# Altium schematic sheet Schematic_radio1.SchDoc
size A1
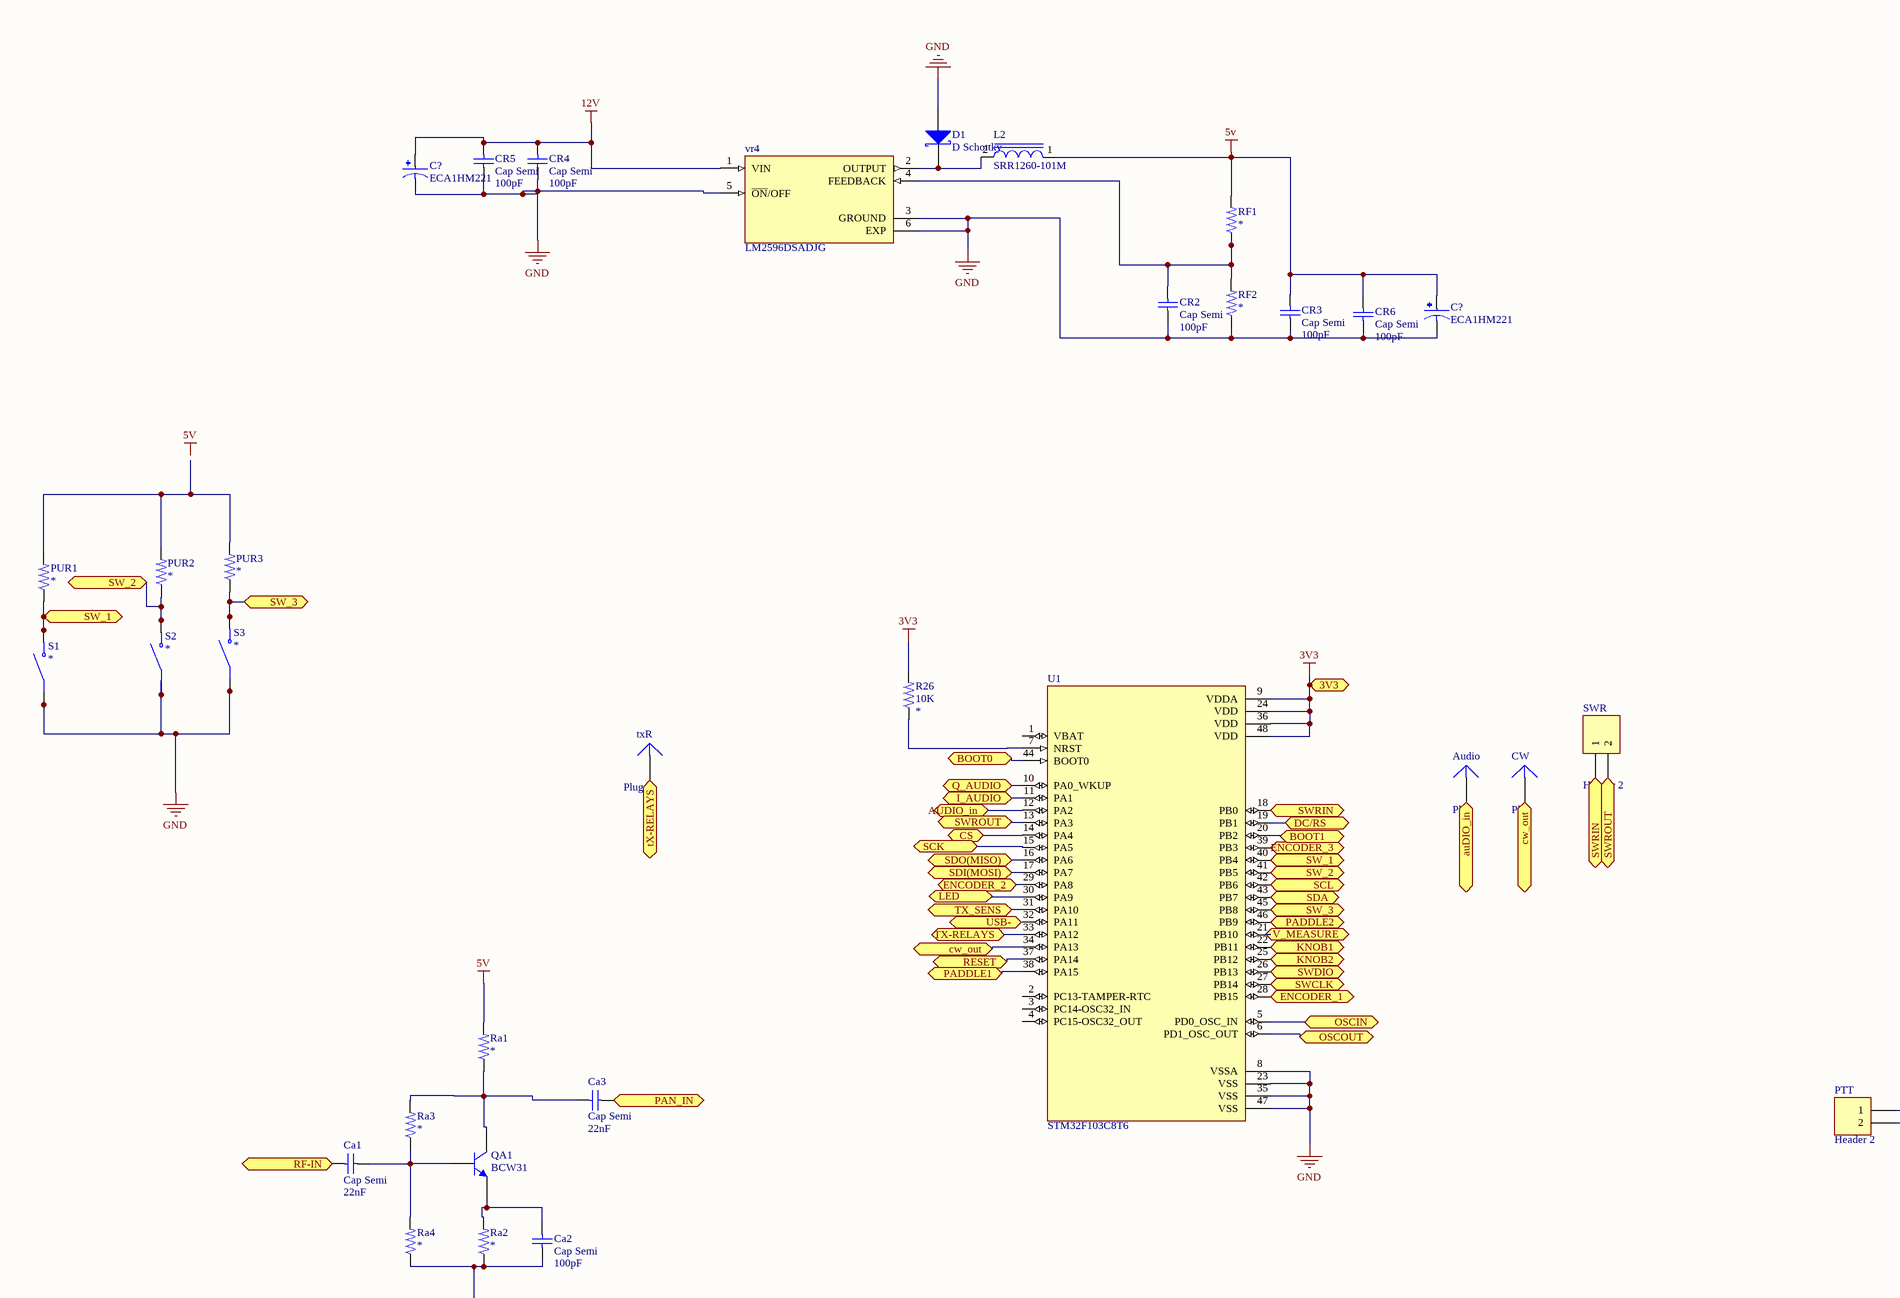
[diagram p0: Schematic_radio1.SchDoc, top left]
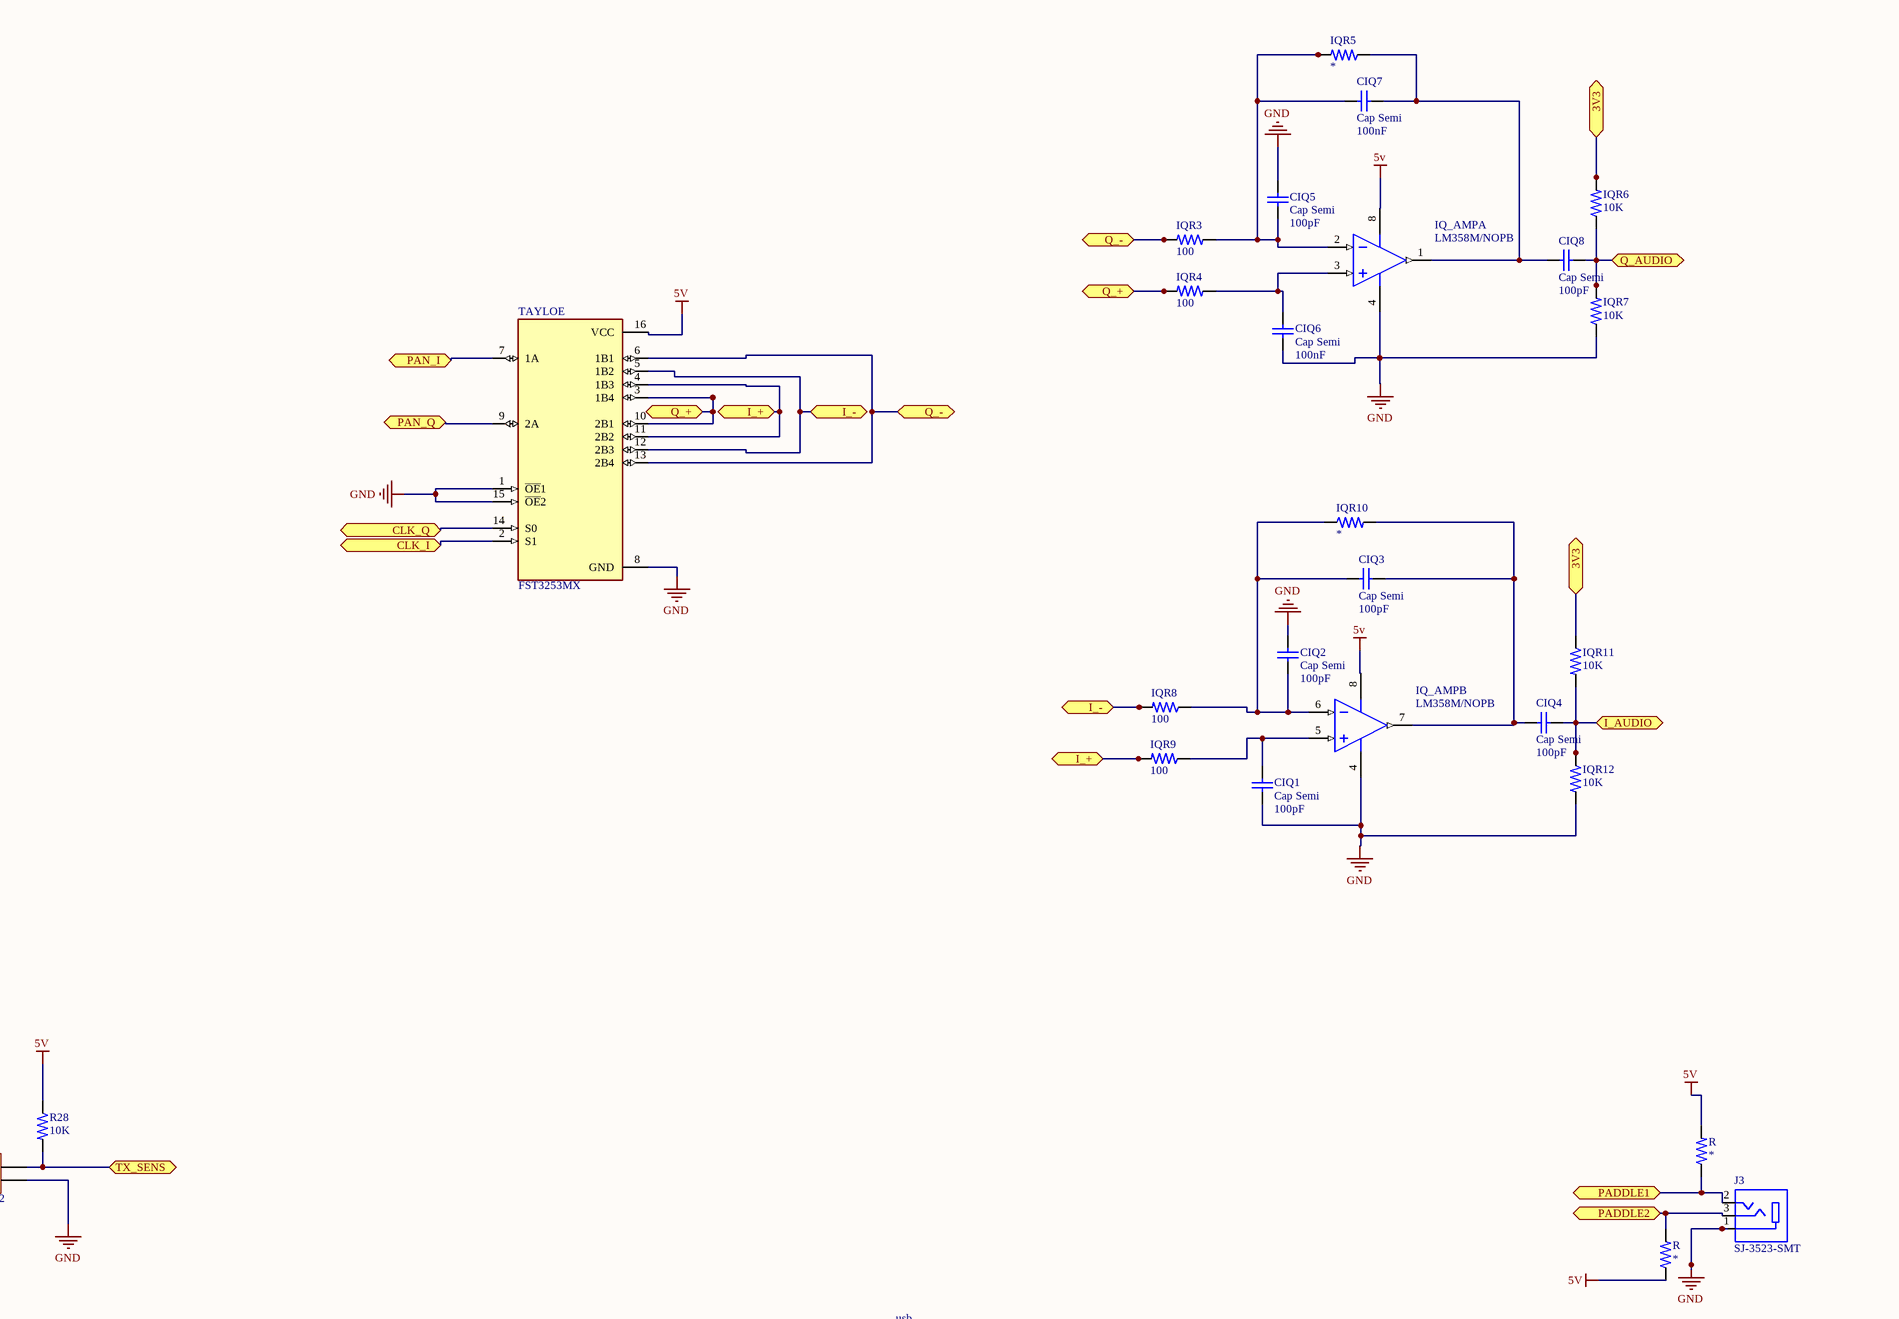
[diagram p1: Schematic_radio1.SchDoc, top right]
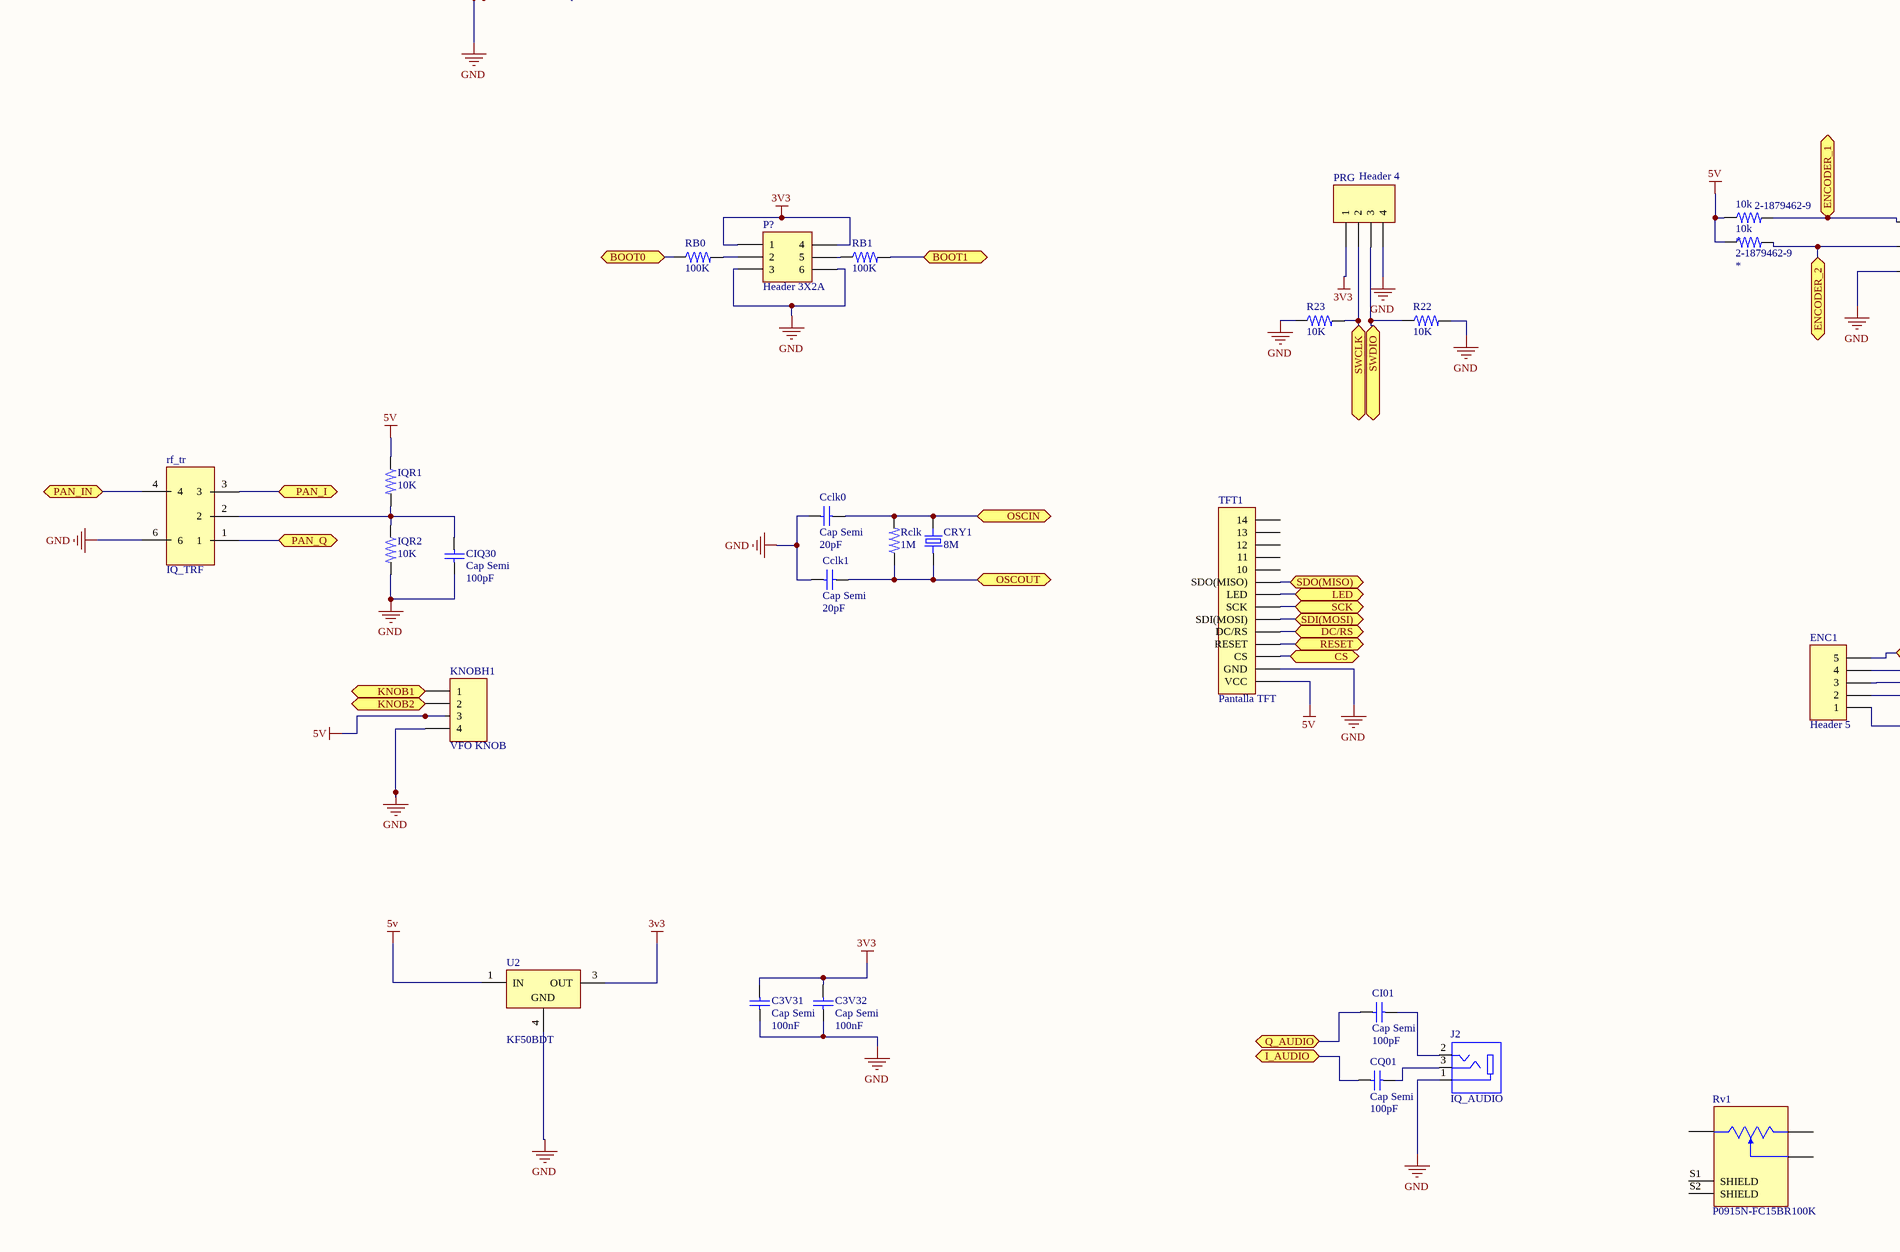
[diagram p2: Schematic_radio1.SchDoc, bottom left]
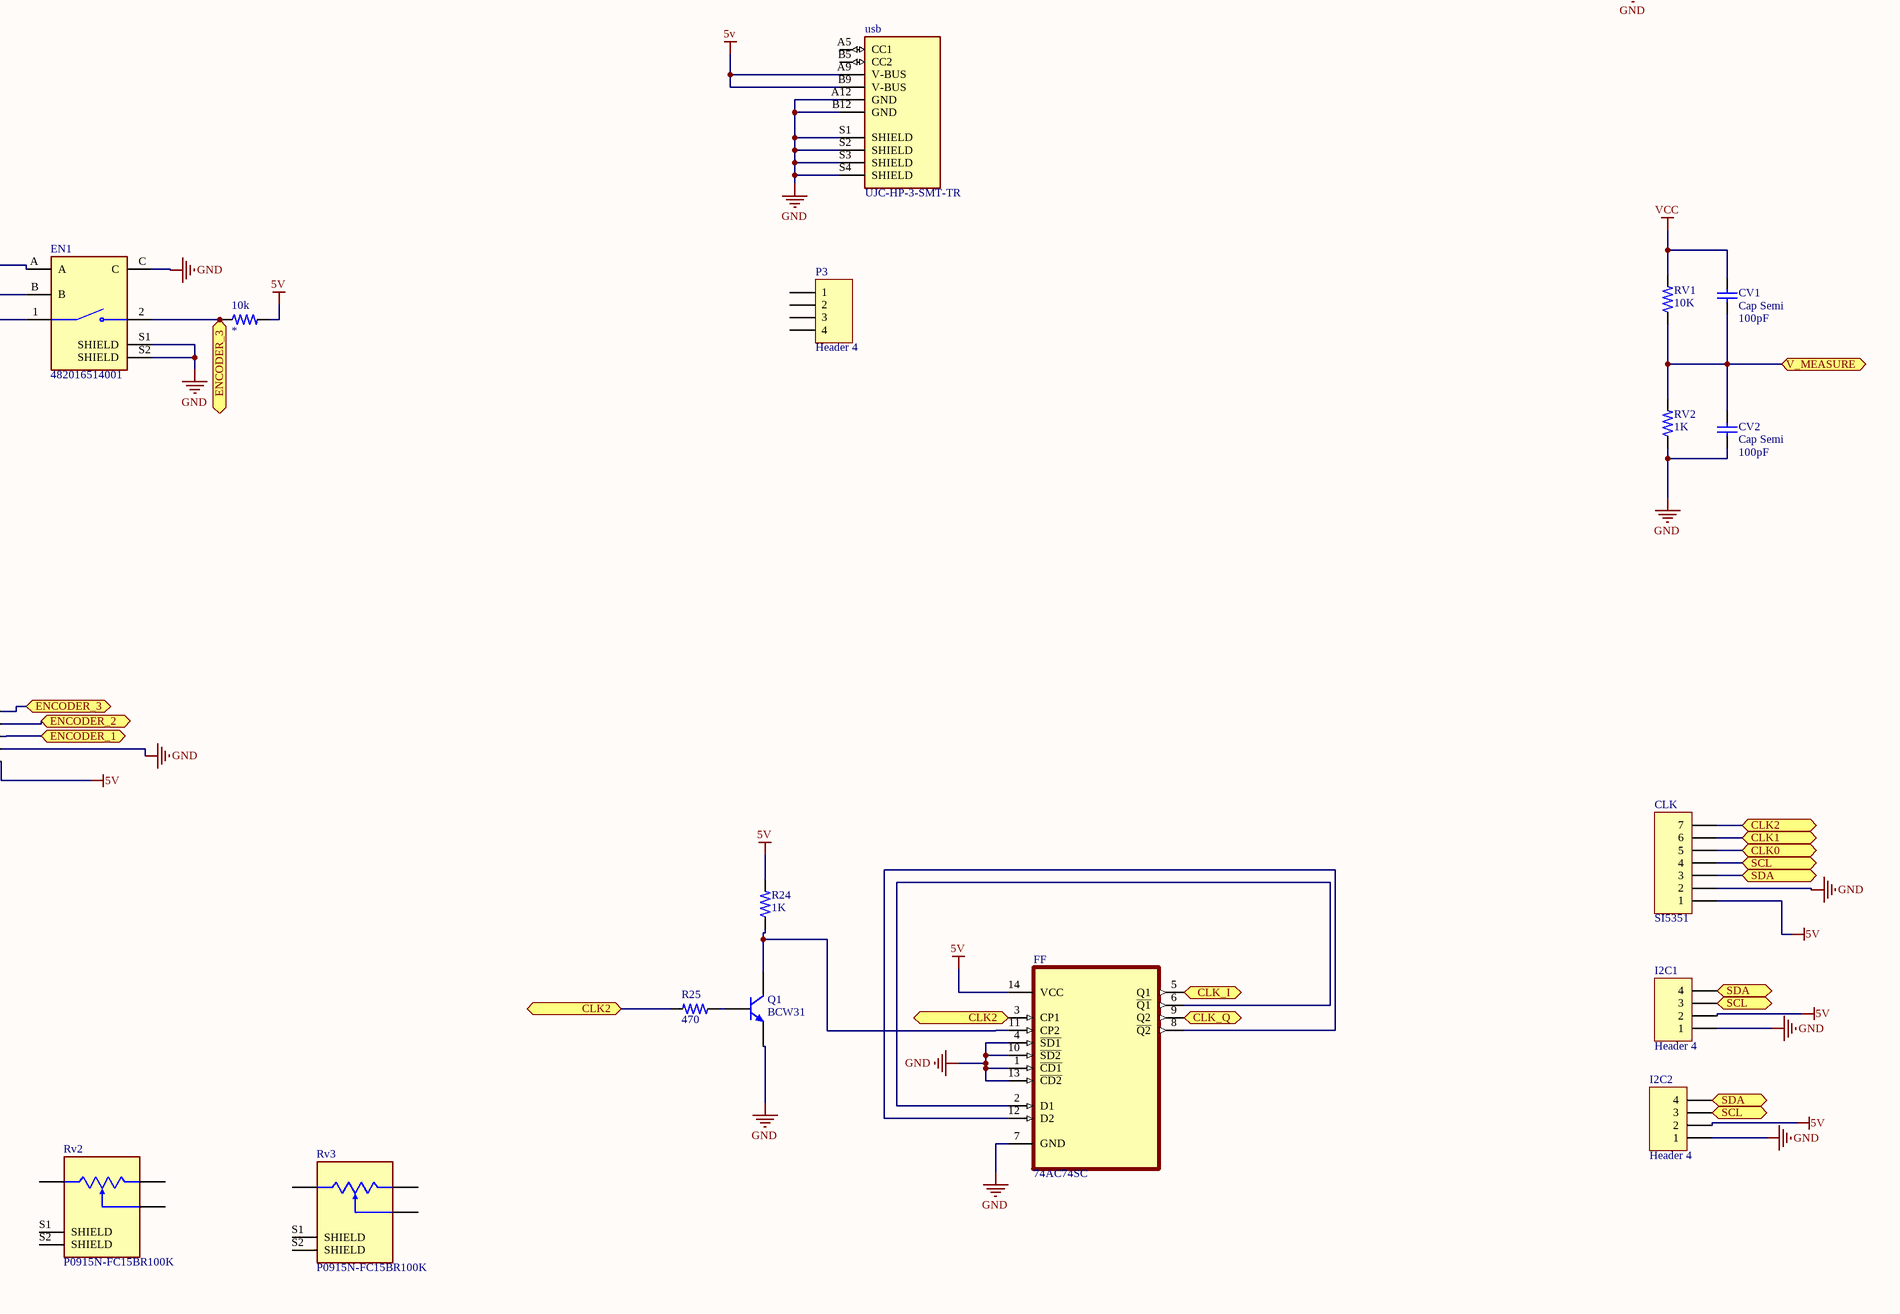
[diagram p3: Schematic_radio1.SchDoc, bottom right]

## Parts
(Parts that share a designator on the sheet are numbered #1, #2 ... from top to bottom, then left to right.)
10k#1  2-1879462-9  [RESC3115X65N]
10k#2  2-1879462-9  [RESC3115X65N]
10k#3  2-1879462-9  [RESC3115X65N]  (value not drawn)
Audio  Plug  [PIN1]
C3V31  Cap Semi  value 100nF  [C1206]
C3V32  Cap Semi  value 100nF  [C1206]
C?#1  ECA1HM221  [CAPPRD500W60D1000H1250]
C?#2  ECA1HM221  [CAPPRD500W60D1000H1250]
Ca1  Cap Semi  value 22nF  [C1206]
Ca2  Cap Semi  value 100pF  [C1206]
Ca3  Cap Semi  value 22nF  [C1206]
Cclk0  Cap Semi  value 20pF  [C1206]
Cclk1  Cap Semi  value 20pF  [C1206]
CI01  Cap Semi  value 100pF  [C1206]
CIQ1  Cap Semi  value 100pF  [C1206]
CIQ2  Cap Semi  value 100pF  [C1206]
CIQ3  Cap Semi  value 100pF  [C1206]
CIQ4  Cap Semi  value 100pF  [C1206]
CIQ5  Cap Semi  value 100pF  [C1206]
CIQ6  Cap Semi  value 100nF  [C1206]
CIQ7  Cap Semi  value 100nF  [C1206]
CIQ8  Cap Semi  value 100pF  [C1206]
CIQ30  Cap Semi  value 100pF  [C1206]
CLK  SI5351  [HDR1X7]
CQ01  Cap Semi  value 100pF  [C1206]
CR2  Cap Semi  value 100pF  [C1206]
CR3  Cap Semi  value 100pF  [C1206]
CR4  Cap Semi  value 100pF  [C1206]
CR5  Cap Semi  value 100pF  [C1206]
CR6  Cap Semi  value 100pF  [C1206]
CRY1  8M  [XTAL_ECS-200-20-1X]
CV1  Cap Semi  value 100pF  [C1206]
CV2  Cap Semi  value 100pF  [C1206]
CW  Plug  [PIN1]
D1  D Schottky  [SMB]
EN1  482016514001  [SW_482016514001]
ENC1  Header 5  [HDR1X5]
FF  74AC74SC  [SOIC127P600X175-14N]
I2C1  Header 4  [HDR1X4]
I2C2  Header 4  [HDR1X4]
IQ_AMP  LM358M/NOPB  [M08A_N]  (parts A,B of 2)
IQR1  Comment_1: 10K  [RESC3115X65N]  (hidden comment: 2-1879462-9)
IQR2  Comment_1: 10K  [RESC3115X65N]  (hidden comment: 2-1879462-9)
IQR3  Comment_1: 100  [RESC3115X65N]  (hidden comment: 2-1879462-9)
IQR4  Comment_1: 100  [RESC3115X65N]  (hidden comment: 2-1879462-9)
IQR5  2-1879462-9  [RESC3115X65N]  (value not drawn)
IQR6  Comment_1: 10K  [RESC3115X65N]  (hidden comment: 2-1879462-9)
IQR7  Comment_1: 10K  [RESC3115X65N]  (hidden comment: 2-1879462-9)
IQR8  Comment_1: 100  [RESC3115X65N]  (hidden comment: 2-1879462-9)
IQR9  Comment_1: 100  [RESC3115X65N]  (hidden comment: 2-1879462-9)
IQR10  2-1879462-9  [RESC3115X65N]  (value not drawn)
IQR11  Comment_1: 10K  [RESC3115X65N]  (hidden comment: 2-1879462-9)
IQR12  Comment_1: 10K  [RESC3115X65N]  (hidden comment: 2-1879462-9)
J2  IQ_AUDIO  [CUI_SJ-3523-SMT]
J3  SJ-3523-SMT  [CUI_SJ-3523-SMT]
KNOBH1  VFO KNOB  [HDR1X4]
L2  SRR1260-101M  [INDP125125X600N]
P3  Header 4  [HDR1X4]
P?  Header 3X2A  [HDR2X3_CEN]
PRG  Header 4  [HDR1X4]
PTT  Header 2  [HDR1X2]
PUR1  2-1879462-9  [RESC3115X65N]  (value not drawn)
PUR2  2-1879462-9  [RESC3115X65N]  (value not drawn)
PUR3  2-1879462-9  [RESC3115X65N]  (value not drawn)
Q1  BCW31  [SOT-23A_N]
QA1  BCW31  [SOT-23A_N]
R22  Comment_1: 10K  [RESC3115X65N]  (hidden comment: 2-1879462-9)
R23  Comment_1: 10K  [RESC3115X65N]  (hidden comment: 2-1879462-9)
R24  Comment_1: 1K  [RESC3115X65N]  (hidden comment: 2-1879462-9)
R25  Comment_1: 470  [RESC3115X65N]  (hidden comment: 2-1879462-9)
R26  10K  [RESC3115X65N]
R28  Comment_1: 10K  [RESC3115X65N]  (hidden comment: 2-1879462-9)
R#1  2-1879462-9  [RESC3115X65N]  (value not drawn)
R#2  2-1879462-9  [RESC3115X65N]  (value not drawn)
Ra1  2-1879462-9  [RESC3115X65N]  (value not drawn)
Ra2  2-1879462-9  [RESC3115X65N]  (value not drawn)
Ra3  2-1879462-9  [RESC3115X65N]  (value not drawn)
Ra4  2-1879462-9  [RESC3115X65N]  (value not drawn)
RB0  Comment_1: 100K  [RESC3115X65N]  (hidden comment: 2-1879462-9)
RB1  Comment_1: 100K  [RESC3115X65N]  (hidden comment: 2-1879462-9)
Rclk  Comment_1: 1M  [RESC3115X65N]  (hidden comment: 2-1879462-9)
RF1  2-1879462-9  [RESC3115X65N]  (value not drawn)
RF2  2-1879462-9  [RESC3115X65N]  (value not drawn)
rf_tr  IQ_TRF  [PCBComponent_1]
RV1#1  Comment_1: 10K  [RESC3115X65N]  (hidden comment: 2-1879462-9)
Rv1#2  P0915N-FC15BR100K  [TRIM_P0915N-FC15BR100K]
RV2#1  Comment_1: 1K  [RESC3115X65N]  (hidden comment: 2-1879462-9)
Rv2#2  P0915N-FC15BR100K  [TRIM_P0915N-FC15BR100K]
Rv3  P0915N-FC15BR100K  [TRIM_P0915N-FC15BR100K]
S1  1571627-1  [SW_1571627-1]  (value not drawn)
S2  1571627-1  [SW_1571627-1]  (value not drawn)
S3  1571627-1  [SW_1571627-1]  (value not drawn)
SWR  Header 2  [HDR1X2]
TAYLOE  FST3253MX  [SOIC127P599X175-16N]
TFT1  Pantalla TFT  [HDR1X14]
txR  Plug  [PIN1]
U1  STM32F103C8T6  [QFP50P900X900X160-48N]
U2  KF50BDT  [TO-252]
usb  UJC-HP-3-SMT-TR  [CUI_UJC-HP-3-SMT-TR]
vr4  LM2596DSADJG  [CONV_LM2596DSADJG]

## Ports
3V3, AUDIO_in, auDIO_in, BOOT0, BOOT1, CLK0, CLK1, CLK2, CLK_I, CLK_Q, CS, cw_out, DC/RS, ENCODER_1, ENCODER_2, ENCODER_3, I_+, I_-, I_AUDIO, KNOB1, KNOB2, LED, OSCIN, OSCOUT, PADDLE1, PADDLE2, PAN_I, PAN_IN, PAN_Q, Q_+, Q_-, Q_AUDIO, RESET, RF-IN, SCK, SCL, SDA, SDA (bidir), SDI(MOSI), SDO(MISO), SW_1, SW_2, SW_3, SWCLK, SWDIO, SWRIN, SWROUT, TX-RELAYS, tX-RELAYS, TX_SENS, USB-, V_MEASURE

## Nets
3V3: C3V31.2 C3V32.2 IQR6.2 IQR11.1 P?.1 P?.4 PRG.1 R26.2 U1.9(VDDA) U1.24(VDD) U1.36(VDD) U1.48(VDD) U2.3(OUT) ; port 3V3
5V: 10k#1.1 10k#2.1 10k#3.2 C?#2.P CLK.1 CR3.2 CR6.2 ENC1.1 FF.14(VCC) I2C1.2 I2C2.2 IQ_AMP.8(V+) IQR1.1 KNOBH1.3 L2.1 R24.2 R28.1 R#1.2 R#2.1 Ra1.2 RF1.2 TAYLOE.16(VCC) TFT1.1(VCC) U2.1(IN) usb.A9(V-BUS) usb.B9(V-BUS)
12V: C?#1.P CR4.2 CR5.2 vr4.1(VIN)
GND: C3V31.1 C3V32.1 C?#1.N C?#2.N Ca2.1 Cclk0.1 Cclk1.1 CIQ1.1 CIQ2.2 CIQ5.2 CIQ6.1 CIQ30.1 CLK.2 CR2.1 CR3.1 CR4.1 CR5.1 CR6.1 CV2.1 D1.1(A) EN1.1 EN1.C EN1.S1(SHIELD) EN1.S2(SHIELD) ENC1.2 FF.1(~{CD1}) FF.4(~{SD1}) FF.7(GND) FF.10(~{SD2}) FF.13(~{CD2}) I2C1.1 I2C2.1 IQ_AMP.4(GND) IQR2.2 IQR7.1 IQR12.2 J2.1 J3.1 KNOBH1.4 P?.3 P?.6 PRG.4 PTT.2 Q1.2(E) R22.2 R23.1 Ra2.1 Ra4.1 RF2.1 rf_tr.6 RV2#1.1 S1.1(COM) S1.2(COM) S2.1(COM) S2.2(COM) S3.1(COM) S3.2(COM) TAYLOE.1(~{OE}1) TAYLOE.8(GND) TAYLOE.15(~{OE}2) TFT1.2(GND) U1.8(VSSA) U1.23(VSS) U1.35(VSS) U1.47(VSS) U2.4(GND) usb.A12(GND) usb.B12(GND) usb.S1(SHIELD) usb.S2(SHIELD) usb.S3(SHIELD) usb.S4(SHIELD) vr4.3(GROUND) vr4.5(~{ON}/OFF) vr4.6(EXP)
VCC: CV1.2 RV1#1.2
AUDIO_in: Audio.1 U1.12(PA2) ; port AUDIO_in, port auDIO_in
BOOT0: RB0.1 U1.44(BOOT0) ; port BOOT0
BOOT1: RB1.2 U1.20(PB2) ; port BOOT1
CLK0: CLK.5 ; port CLK0
CLK1: CLK.6 ; port CLK1
CLK2: CLK.7 FF.3(CP1) R25.2 ; port CLK2
CLK_I: FF.5(Q1) TAYLOE.2(S1) ; port CLK_I
CLK_Q: FF.9(Q2) TAYLOE.14(S0) ; port CLK_Q
CS: TFT1.3(CS) U1.14(PA4) ; port CS
cw_out: CW.1 U1.34(PA13) ; port cw_out
DC/RS: TFT1.5(DC/RS) U1.19(PB1) ; port DC/RS
ENCODER_1: 10k#1.2 EN1.A ENC1.3 U1.28(PB15) ; port ENCODER_1
ENCODER_2: 10k#2.2 EN1.B ENC1.4 U1.29(PA8) ; port ENCODER_2
ENCODER_3: 10k#3.1 EN1.2 ENC1.5 U1.39(PB3) ; port ENCODER_3
I_+: IQR9.2 TAYLOE.4(1B3) TAYLOE.11(2B2) ; port I_+
I_-: IQR8.2 TAYLOE.5(1B2) TAYLOE.12(2B3) ; port I_-
I_AUDIO: CIQ4.2 CQ01.1 IQR11.2 IQR12.1 U1.11(PA1) ; port I_AUDIO
KNOB1: KNOBH1.1 U1.22(PB11) ; port KNOB1
KNOB2: KNOBH1.2 U1.25(PB12) ; port KNOB2
LED: TFT1.8(LED) U1.30(PA9) ; port LED
OSCIN: Cclk0.2 CRY1.2 Rclk.2 U1.5(PD0_OSC_IN) ; port OSCIN
OSCOUT: Cclk1.2 CRY1.1 Rclk.1 U1.6(PD1_OSC_OUT) ; port OSCOUT
PADDLE1: J3.2 R#1.1 U1.38(PA15) ; port PADDLE1
PADDLE2: J3.3 R#2.2 U1.46(PB9) ; port PADDLE2
PAN_I: rf_tr.3 TAYLOE.7(1A) ; port PAN_I
PAN_IN: Ca3.1 rf_tr.4 ; port PAN_IN
PAN_Q: rf_tr.1 TAYLOE.9(2A) ; port PAN_Q
Q_+: IQR4.2 TAYLOE.3(1B4) TAYLOE.10(2B1) ; port Q_+
Q_-: IQR3.2 TAYLOE.6(1B1) TAYLOE.13(2B4) ; port Q_-
Q_AUDIO: CI01.1 CIQ8.2 IQR6.1 IQR7.2 U1.10(PA0_WKUP) ; port Q_AUDIO
RESET: TFT1.4(RESET) U1.37(PA14) ; port RESET
RF-IN: Ca1.1 ; port RF-IN
SCK: TFT1.7(SCK) U1.15(PA5) ; port SCK
SCL: CLK.4 I2C1.3 I2C2.3 U1.42(PB6) ; port SCL
SDA: CLK.3 I2C1.4 I2C2.4 U1.43(PB7) ; port SDA
SDI(MOSI): TFT1.6(SDI(MOSI)) U1.17(PA7) ; port SDI(MOSI)
SDO(MISO): TFT1.9(SDO(MISO)) U1.16(PA6) ; port SDO(MISO)
SW_1: PUR1.1 S1.3(NO) S1.4(NO) U1.40(PB4) ; port SW_1
SW_2: PUR2.1 S2.3(NO) S2.4(NO) U1.41(PB5) ; port SW_2
SW_3: PUR3.1 S3.3(NO) S3.4(NO) U1.45(PB8) ; port SW_3
SWCLK: PRG.2 R23.2 U1.27(PB14) ; port SWCLK
SWDIO: PRG.3 R22.1 U1.26(PB13) ; port SWDIO
SWRIN: SWR.1 U1.18(PB0) ; port SWRIN
SWROUT: SWR.2 U1.13(PA3) ; port SWROUT
TX-RELAYS: txR.1 U1.33(PA12) ; port TX-RELAYS, port tX-RELAYS
TX_SENS: PTT.1 R28.2 U1.31(PA10) ; port TX_SENS
V_MEASURE: CV1.1 CV2.2 RV1#1.1 RV2#1.2 U1.21(PB10) ; port V_MEASURE
NetCa1_2: Ca1.2 QA1.1(B) Ra3.1 Ra4.2
NetCa2_2: Ca2.2 QA1.2(E) Ra2.2
NetCa3_2: Ca3.2 QA1.3(C) Ra1.1 Ra3.2
NetCI01_2: CI01.2 J2.2
NetCIQ1_2: CIQ1.2 IQ_AMP.5(INB+) IQR9.1
NetCIQ2_1: CIQ2.1 CIQ3.2 IQ_AMP.6(INB-) IQR8.1 IQR10.1
NetCIQ3_1: CIQ3.1 CIQ4.1 IQ_AMP.7(OUTB) IQR10.2
NetCIQ5_1: CIQ5.1 CIQ7.2 IQ_AMP.2(INA-) IQR3.1 IQR5.2
NetCIQ6_2: CIQ6.2 IQ_AMP.3(INA+) IQR4.1
NetCIQ7_1: CIQ7.1 CIQ8.1 IQ_AMP.1(OUTA) IQR5.1
NetCIQ30_2: CIQ30.2 IQR1.2 IQR2.1 rf_tr.2
NetCQ01_2: CQ01.2 J2.3
NetCR2_2: CR2.2 RF1.1 RF2.2 vr4.4(FEEDBACK)
NetD1_2: D1.2(K) L2.2 vr4.2(OUTPUT)
NetFF_2: FF.2(D1) FF.6(~{Q1})
NetFF_8: FF.8(~{Q2}) FF.12(D2)
NetFF_11: FF.11(CP2) Q1.3(C) R24.1
NetP?_2: P?.2 RB0.2
NetP?_5: P?.5 RB1.1
NetPUR1_2: PUR1.2 PUR2.2 PUR3.2
NetQ1_1: Q1.1(B) R25.1
NetR26_1: R26.1 U1.7(NRST)

Not connected (* = marked no-connect by the designer): P3 1 2 3 4; Rv1#2 1 2 3 S1(SHIELD) S2(SHIELD); Rv2#2 1 2 3 S1(SHIELD) S2(SHIELD); Rv3 1 2 3 S1(SHIELD) S2(SHIELD); TFT1 10 11 12 13 14; U1 1(VBAT) 2(PC13-TAMPER-RTC) 3(PC14-OSC32_IN) 4(PC15-OSC32_OUT) 32(PA11); usb A5(CC1) B5(CC2)

## Notes on the sheet
- Labels drawn without touching a wire or pin: 5V

## Library data of the parts
10k#1-10k#3 IQR1-IQR12 PUR1-PUR3 R22-R26 R28 R#1 R#2 Ra1-Ra4 RB0 RB1 Rclk RF1 RF2 RV1#1 RV2#1 = 2-1879462-9: RES 0.24 OHM 1% 1/4W 1206; Resistance: 24; Power_Rating: .25 W; MF: TE Connectivity; Package: 1206; Value: *; MP: 2-1879462-9; Price: None; Availability: Unavailable; SnapEDA_Link: https://www.snapeda.com/parts/2-1879462-9/TE%20Connectivity/view-part/2213899/?ref=snap; EU_RoHS_Compliance: Compliant with Exemptions; Tolerance: 1%
  10k#1-10k#3 IQR5 IQR10 PUR1-PUR3 R26 R#1 R#2 Ra1-Ra4 RF1 RF2: Comment_1: *
C3V31 C3V32 Ca1-Ca3 Cclk0 Cclk1 CI01 CIQ1-CIQ8 CIQ30 CQ01 CR2-CR6 CV1 CV2 = Cap Semi: Capacitor (Semiconductor SIM Model); Published: 8-Jun-2000; LatestRevisionDate: 29-May-2009; LatestRevisionNote: IPC-7351 Footprint Added.; PackageReference: C1206; Publisher: Altium Limited; PackageDescription: Chip Capacitor
C?#1 C?#2 = ECA1HM221: 220ÂµF 50V Aluminum Electrolytic Capacitors Radial, Can 2000 Hrs @ 85Â°C; MF: Panasonic; Digi-Key_Part_Number: P10398TB-ND; SnapEDA_Link: https://www.snapeda.com/parts/ECA1HM221/Panasonic/view-part/5793400/?ref=snap; Check_prices: https://www.snapeda.com/parts/ECA1HM221/Panasonic/view-part/5793400/?ref=eda; Package: RADIAL-2 Panasonic; MP: ECA1HM221; Value: *
CLK = Header 7: Header, 7-Pin; LatestRevisionDate: 17-Jul-2002; LatestRevisionNote: Re-released for DXP Platform.; Publisher: Altium Limited
CRY1 = ECS-240.0001-18-1X: Crystals / Oscillators / Resonators 24.00014MHz 18pF; MF: ECS International; Package: HC49/U ECS International; Availability: Unavailable; Value: *; MP: ECS-240.0001-18-1X; Price: None; SnapEDA_Link: https://www.snapeda.com/parts/ECS-240.0001-18-1X/ECS%20International/view-part/259232/?ref=snap
D1 = D Schottky: Schottky Diode; Published: 8-Jun-2000; LatestRevisionDate: 17-Jul-2002; LatestRevisionNote: Re-released for DXP Platform.; PackageReference: SMB; Publisher: Altium Limited; PackageDescription: DO-214-AA/SMB; 2 C-Bend Leads; Body 5.3 x 3.6 mm, inc. leads (LxW); Code_JEDEC: DO-214-AA
EN1 = 482016514001: Rotary Encoder Mechanical 15 Quadrature (Incremental) Vertical; MF: WÃ¼rth Elektronik; Purchase-URL: https://pricing.snapeda.com/search/part/482016514001/?ref=eda; MP: 482016514001; Package: None; Availability: In Stock; Value: *; Price: None; Check_prices: https://www.snapeda.com/parts/482016514001/Wurth+Electronics+Inc./view-part/?ref=eda; SnapEDA_Link: https://www.snapeda.com/parts/482016514001/Wurth+Electronics+Inc./view-part/?ref=snap
ENC1 = Header 5: Header, 5-Pin; LatestRevisionDate: 17-Jul-2002; LatestRevisionNote: Re-released for DXP Platform.; Publisher: Altium Limited
FF = 74AC74SC: Dual D-Type Positive Edge-Triggered Flip-Flop; Package: None; Price: None; Value: *; MP: 74AC74SC; Availability: Unavailable
I2C1 I2C2 KNOBH1 P3 PRG = Header 4: Header, 4-Pin; LatestRevisionDate: 17-Jul-2002; LatestRevisionNote: Re-released for DXP Platform.; Publisher: Altium Limited
IQ_AMP = LM358M/NOPB: Low Power Dual Operational Amplifier, 8-pin Narrow SOIC, Pb-Free; Manufacturer: National Semiconductor; PackageTopMarking: NSZXTT*LM*358M; PowerWise: N; CompType: Amplifiers; Published: 1-Mar-2010; DatasheetVersion: Oct-2005; PackageVersion: revM, May-2009; PackageReference: M08A; Publisher: Altium Limited; PackageDescription: SOIC Narrow, 4.9 x 3.9 x 1.45mm, 8 Lead, 1.27mm Pitch; Supplier 1: Digi-Key; Supplier Part Number 1: LM358MNS-ND; Supplier 2: Farnell; Supplier Part Number 2: 1468920; PartNumber: LM358M/NOPB; RoHS: Y; PinCount: 8; Code_JEDEC: MS-012-AA; Code_IPC: SOIC127P600-8; ComponentLink1Description: LM358 Datasheet; ComponentLink1URL: http://www.national.com/ds/LM/LM358.pdf; ComponentLink2Description: LM358 Web Page; ComponentLink2URL: http://www.national.com/pf/LM/LM358.html; ComponentLink3Description: M08A Package Page; ComponentLink3URL: http://www.national.com/packaging/folders/m08a.html
J2 J3 = SJ-3523-SMT: 3.50mm _0.141, 1/8, Mini Plug_ - Headphone Phone Jack Stereo _3 Conductor, TRS_ Connector Solder; MF: CUI Devices; Package: None; Availability: Unavailable; Value: *; MP: SJ-3523-SMT; SnapEDA_Link: https://www.snapeda.com/parts/SJ-3523-SMT/CUI%20Devices/view-part/278287/?ref=snap; Price: None
L2 = SRR1260-101M: 100ÂµH Shielded Wirewound Inductor 1.7A 180mOhm Max Nonstandard; MF: Bourns; Value: *; SnapEDA_Link: https://www.snapeda.com/parts/SRR1260-101M/Bourns/view-part/1233146/?ref=snap; MP: SRR1260-101M; Availability: Unavailable; Price: None; Package: Nonstandard Bourns
P? = Header 3X2A: Header, 3-Pin, Dual row; LatestRevisionDate: 17-Jul-2002; LatestRevisionNote: Re-released for DXP Platform.; Publisher: Altium Limited
PTT SWR = Header 2: Header, 2-Pin; LatestRevisionDate: 17-Jul-2002; LatestRevisionNote: Re-released for DXP Platform.; Publisher: Altium Limited
Q1 QA1 = BCW31: NPN Epitaxial Silicon Transistor; Published: 8-Jun-2000; LatestRevisionDate: 20-Nov-2009; LatestRevisionNote: IPC-7351 Footprint Added.; DatasheetVersion: 1999; PackageVersion: Sep-1998; PackageReference: SOT-23A; Publisher: Altium Limited; PackageDescription: 3-Pin SOT-23 Package 0.95 mm Pitch, 2.3 mm Lead Span; ComponentLink1Description: Manufacturer Link; ComponentLink1URL: http://www.fairchildsemi.com/; ComponentLink2Description: Datasheet; ComponentLink2URL: http://www.fairchildsemi.com/ds/BC%2FBCW31.pdf
rf_tr = Component_1: micro rf transformer
Rv1#2 Rv2#2 Rv3 = P0915N-FC15BR100K: Res Conductive Plastic POT 100K Ohm 20% 0.05W(1/20W) 1(Elec)/1(Mech)Turns 6mm (12.1 X 14.85 X 28.5mm) Pin Panel Mount/Through Hole Box/Tray; MF: BI Technologies (TT electronics); Check_prices: https://www.snapeda.com/parts/P0915N-FC15BR100K/BI+Technologies/view-part/?ref=eda; Value: *; Availability: In Stock; MP: P0915N-FC15BR100K; Price: None; Package: None; SnapEDA_Link: https://www.snapeda.com/parts/P0915N-FC15BR100K/BI+Technologies/view-part/?ref=snap; Purchase-URL: https://pricing.snapeda.com/search/part/P0915N-FC15BR100K/?ref=eda
S1-S3 = 1571627-1: Switch Tactile OFF (ON) SPST Extended Square Button PC Pins 0.05A 12VDC 2.55N Thru-Hole Loose Piece; MF: TE Connectivity / AMP; Value: *; SnapEDA_Link: https://www.snapeda.com/parts/1571627-1/TE+Connectivity+%252F+AMP/view-part/?ref=snap; EU_RoHS_Compliance: Compliant; Availability: In Stock; Price: None; Package: None; Check_prices: https://www.snapeda.com/parts/1571627-1/TE+Connectivity+%252F+AMP/view-part/?ref=eda; MP: 1571627-1; Comment_1: *
TAYLOE = FST3253MX: Multiplexer/Demultiplexer 2 x 4:1 16-SOIC; MF: Rochester Electronics, LLC; Availability: In Stock; Check_prices: https://www.snapeda.com/parts/FST3253MX/Rochester+Electronics/view-part/?ref=eda; SnapEDA_Link: https://www.snapeda.com/parts/FST3253MX/Rochester+Electronics/view-part/?ref=snap; Value: *; Price: None; Purchase-URL: https://pricing.snapeda.com/search/part/FST3253MX/?ref=eda; Package: SOIC-16 ON Semiconductor; MP: FST3253MX
TFT1 = Header 14: Header, 14-Pin; LatestRevisionDate: 17-Jul-2002; LatestRevisionNote: Re-released for DXP Platform.; Publisher: Altium Limited
U1 = STM32F103C8T6: ARMÂ® CortexÂ®-M3 STM32F1 Microcontroller IC 32-Bit 72MHz 64KB (64K x 8) FLASH 48-LQFP (7x7); MF: STMicroelectronics; Package: LQFP-48 STMicroelectronics; Price: None; Check_prices: https://www.snapeda.com/parts/STM32F103C8T6/STMicroelectronics/view-part/?ref=eda; Value: *; SnapEDA_Link: https://www.snapeda.com/parts/STM32F103C8T6/STMicroelectronics/view-part/?ref=snap; MP: STM32F103C8T6; Availability: In Stock; Purchase-URL: https://pricing.snapeda.com/search/part/STM32F103C8T6/?ref=eda
U2 = KF50BDT: 500mA, Very Low Drop (0.4V) Voltage Regulator; Published: 24-Aug-2001; LatestRevisionDate: 06-Jun-2005; LatestRevisionNote: PCB pads lengthened.; DatasheetVersion: Jun-1998; PackageVersion: Jun-2004; PackageReference: TO-252; Publisher: Altium Limited; PackageDescription: D-PAK/TO-252-AA; 3 Leads (1 Cropped); Body 10.1 (inc. leads) x 6.6 mm (LxW max); ComponentLink1Description: Manufacturer Link; ComponentLink1URL: http://www.st.com/; ComponentLink2Description: Datasheet; ComponentLink2URL: http://www.st.com/stonline/products/literature/ds/4337/kf120b.pdf
usb = UJC-HP-3-SMT-TR: Type C, 3 A, Right Angle, Surface Mount (SMT), Power-Only USB Receptacle; Value: *; Availability: Unavailable; Price: None; Package: None; MP: UJC-HP-3-SMT-TR
vr4 = LM2596DSADJG: Buck, Boost, Buck-Boost Switching Regulator IC Positive or Negative Adjustable 1.23V 1 Output 3A TO-263-6, DÂ²Pak (5 Leads + Tab), TO-263BA; MF: ON Semiconductor; Value: *; SnapEDA_Link: https://www.snapeda.com/parts/LM2596DSADJG/Onsemi/view-part/?ref=snap; MP: LM2596DSADJG; Purchase-URL: https://pricing.snapeda.com/search/part/LM2596DSADJG/?ref=eda; Check_prices: https://www.snapeda.com/parts/LM2596DSADJG/Onsemi/view-part/?ref=eda; Availability: In Stock; Price: None; Package: D2PAK-5 ON Semiconductor
Audio CW txR = Plug: LatestRevisionDate: 17-Jul-2002; LatestRevisionNote: Re-released for DXP Platform.; Publisher: Altium Limited